# Altium schematic sheet 外围.SchDoc
size A4; SheetNumber: 2; SheetTotal: 5
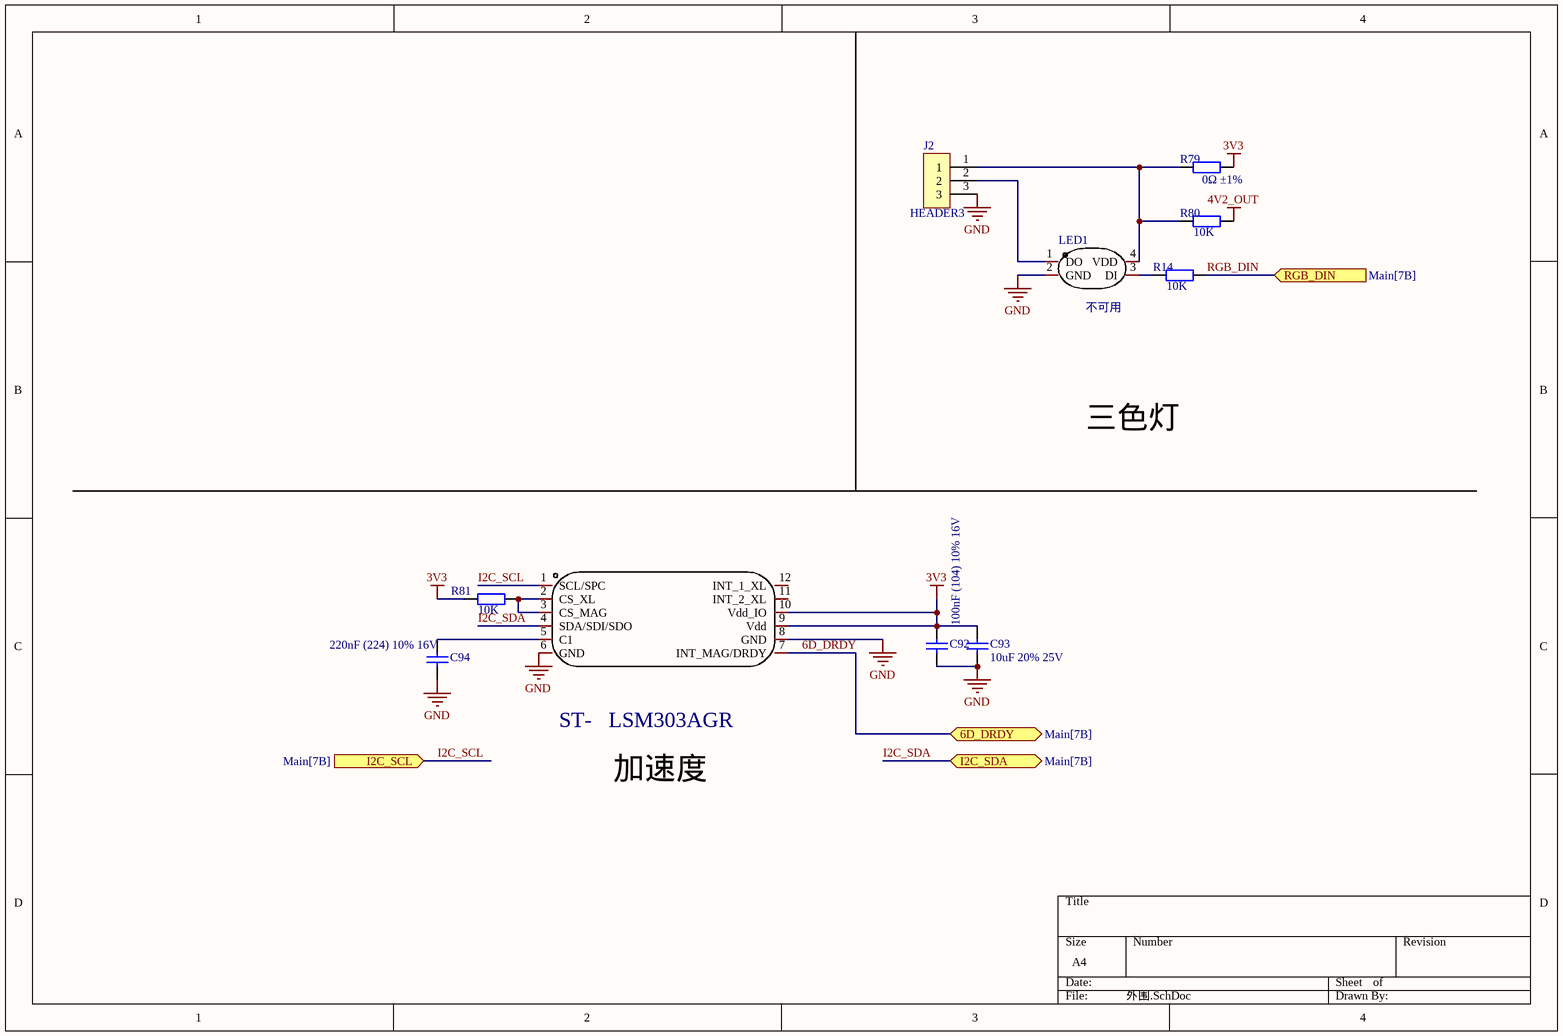
[diagram p0: 外围.SchDoc]

## Parts
C92  100nF (104) 10% 16V  [0402_C]
C93  10uF 20% 25V  [0402_C]
C94  220nF (224) 10% 16V  [0201_C]
J2  HEADER3  [HEADER3]
LED1  WS2812B-2020  [LED-SMD_4P-L2.0-W2.0-TL_WS2812B-2020]  (value not drawn)
R14  10K  [0402_R]
R79  0Ω ±1%  [0402_R]
R80  value 10K  [0402_R]  (hidden comment: NC)
R81  10K  [0201_R]
U15  LSM303AGRTR  [LGA-12_L2.0-W2.0-P0.50-BL]  (value not drawn)

## Ports
6D_DRDY (bidir, see Main[7B]), I2C_SCL (in, see Main[7B]), I2C_SDA (bidir, see Main[7B]), RGB_DIN (in, see Main[7B])

## Nets
3V3: C92.2 C93.2 R79.2 R81.1 U15.9(Vdd) U15.10(Vdd_IO)
4V2_OUT: R80.2
GND: C92.1 C93.1 C94.1 J2.3 LED1.2(GND) U15.6(GND) U15.8(GND)
6D_DRDY: U15.7(INT_MAG/DRDY) ; port 6D_DRDY
I2C_SCL: U15.1(SCL/SPC) ; port I2C_SCL
I2C_SDA: U15.4(SDA/SDI/SDO) ; port I2C_SDA
RGB_DIN: R14.2 ; port RGB_DIN
NetC94_2: C94.2 U15.5(C1)
NetJ2_1: J2.1 LED1.4(VDD) R79.1 R80.1
NetJ2_2: J2.2 LED1.1(DO)
NetLED1_3: LED1.3(DI) R14.1
NetR81_2: R81.2 U15.2(CS_XL) U15.3(CS_MAG)

Not connected (* = marked no-connect by the designer): U15 11(INT_2_XL) 12(INT_1_XL)

## Notes on the sheet
- (near LED1) 不可用
- 三色灯
- ST-   LSM303AGR
- 加速度

## Library data of the parts
C92 = 0402 100nF (104) 10% 16V: 贴片电容; ComponentLink1Description: 供应商链接; ComponentLink1URL: http://www.szlcsc.com/product/details_1877.html; Package: 0402; Supplier: LC; SuppliersPartNumber: C1525
C93 = 0402 10uF (106) 20% 6.3V: 贴片电容; ComponentLink1Description: 供应商链接; ComponentLink1URL: http://www.szlcsc.com/product/details_16204.html; Package: 0402; Supplier: LC; SuppliersPartNumber: C15525
C94 = 0402 220nF (224) 10% 16V: 贴片电容; ComponentLink1Description: 供应商链接; ComponentLink1URL: http://www.szlcsc.com/product/details_17456.html; Package: 0402; Supplier: LC; SuppliersPartNumber: C16772
LED1 = WS2812B-2020: 发光颜色:RGB三色;二极管配置:-;功率:-;透镜颜色:-;主波长:470.4nm；622.5nm；515.6nm;色温:-;发光角度:-;安装方式:-;工作温度:-;; Manufacturer: worldsemi; Add into BOM: yes; Emitted Color: RGB三色; Forward Current: 12mA; Name: WS2812B-2020; Symbol: WS2812B-2020; Device: WS2812B-2020; LCSC Part Name: RGB三色 （注意防潮，请查阅规格书中对应具体内容）; Supplier Part: C965555; Manufacturer Part: WS2812B-2020; Supplier Footprint: SMD,2x2mm; JLCPCB Part Class: 扩展库; Datasheet: https://atta.szlcsc.com/upload/public/pdf/source/20201203/C965555_5C919C4B6231E6ADE06011FB0D94282B.pdf; Supplier: LCSC; Convert to PCB: yes; Diode Configuration: -; Power Dissipation: -; Lens Color: -; Dominant Wavelength: 470.4nm；622.5nm；515.6nm; Peak Wavelength: -; Color Temperature: -; Viewing Angle: -; Mounting Sytle: -; Operating Temperature: -
R14 R79-R81 = Res2: Resistor
  R14 R81: Value: 10K
U15 = LSM303AGRTR: Manufacturer: ST(意法半导体); Add into BOM: yes; Name: LSM303AGRTR; Symbol: LSM303AGRTR; Device: LSM303AGRTR; LCSC Part Name: LSM303AGRTR; Supplier Part: C126671; Manufacturer Part: LSM303AGRTR; Supplier Footprint: LGA-12; JLCPCB Part Class: Extended Part; Datasheet: https://atta.szlcsc.com/upload/public/pdf/source/20180403/C126671_E4CABC5ABBEC58D74E548CEDEFA0489C.pdf; Supplier: LCSC; Convert to PCB: yes